# EAGLE design 18500_pack_v1 (EAGLE 9.6.2)
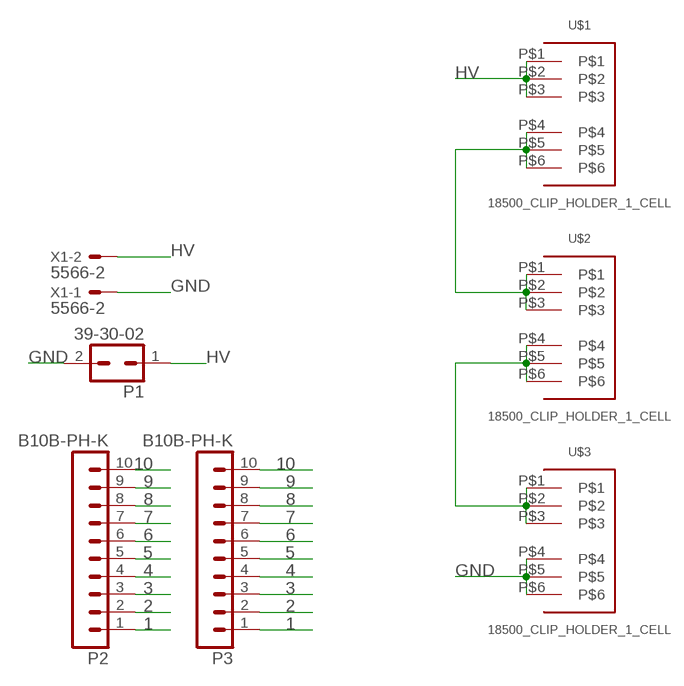
[diagram p0: schematic, sheet 1]

## Parts
P1  39-30-02  [39-30-?02?]
P2  B10B-PH-K  [B10B-PH-K]
P3  B10B-PH-K  [B10B-PH-K]
U$1  18500_CLIP_HOLDER_1_CELL  [3PINBATTERY_CLIP_1_CELL_18500]
U$2  18500_CLIP_HOLDER_1_CELL  [3PINBATTERY_CLIP_1_CELL_18500]
U$3  18500_CLIP_HOLDER_1_CELL  [3PINBATTERY_CLIP_1_CELL_18500]
X1  5566-2  [5566-2]

## Nets
1: P2.1 P3.1
2: P2.2 P3.2
3: P2.3 P3.3
4: P2.4 P3.4
5: P2.5 P3.5
6: P2.6 P3.6
7: P2.7 P3.7
8: P2.8 P3.8
9: P2.9 P3.9
10: P2.10 P3.10
GND: P1.2 U$3.P$4 U$3.P$5 U$3.P$6 X1.1
HV: P1.1 U$1.P$1 U$1.P$2 U$1.P$3 X1.2
N$1: U$1.P$4 U$1.P$5 U$1.P$6 U$2.P$1 U$2.P$2 U$2.P$3
N$2: U$2.P$4 U$2.P$5 U$2.P$6 U$3.P$1 U$3.P$2 U$3.P$3

## Library data of the parts
P1 = con-molex-mini-fit:39-30-?02?: HEADER
P2 P3 = con-jst-ph:B10B-PH-K: HEADER
U$1-U$3 = nathans-custom-parts:18500_CLIP_HOLDER_1_CELL
X1 = con-molex:5566-2: Mini FIT connector 2 pol Source: http://www.molex.com; MF: MOLEX; OC_FARNELL: 1822072; OC_NEWARK: unknown

## Board
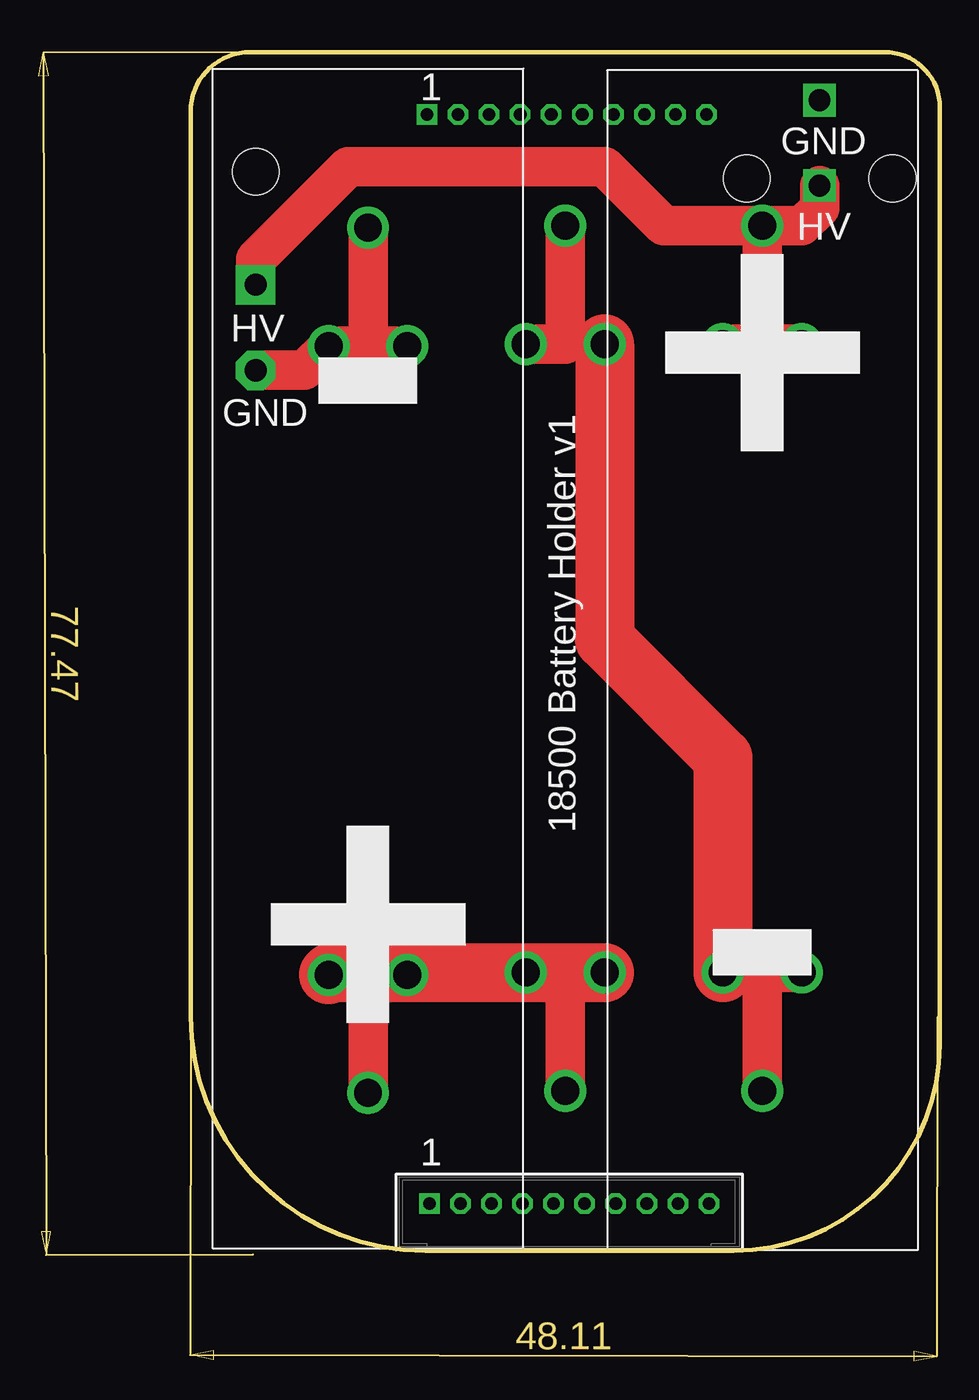
[diagram p1: board, top side]
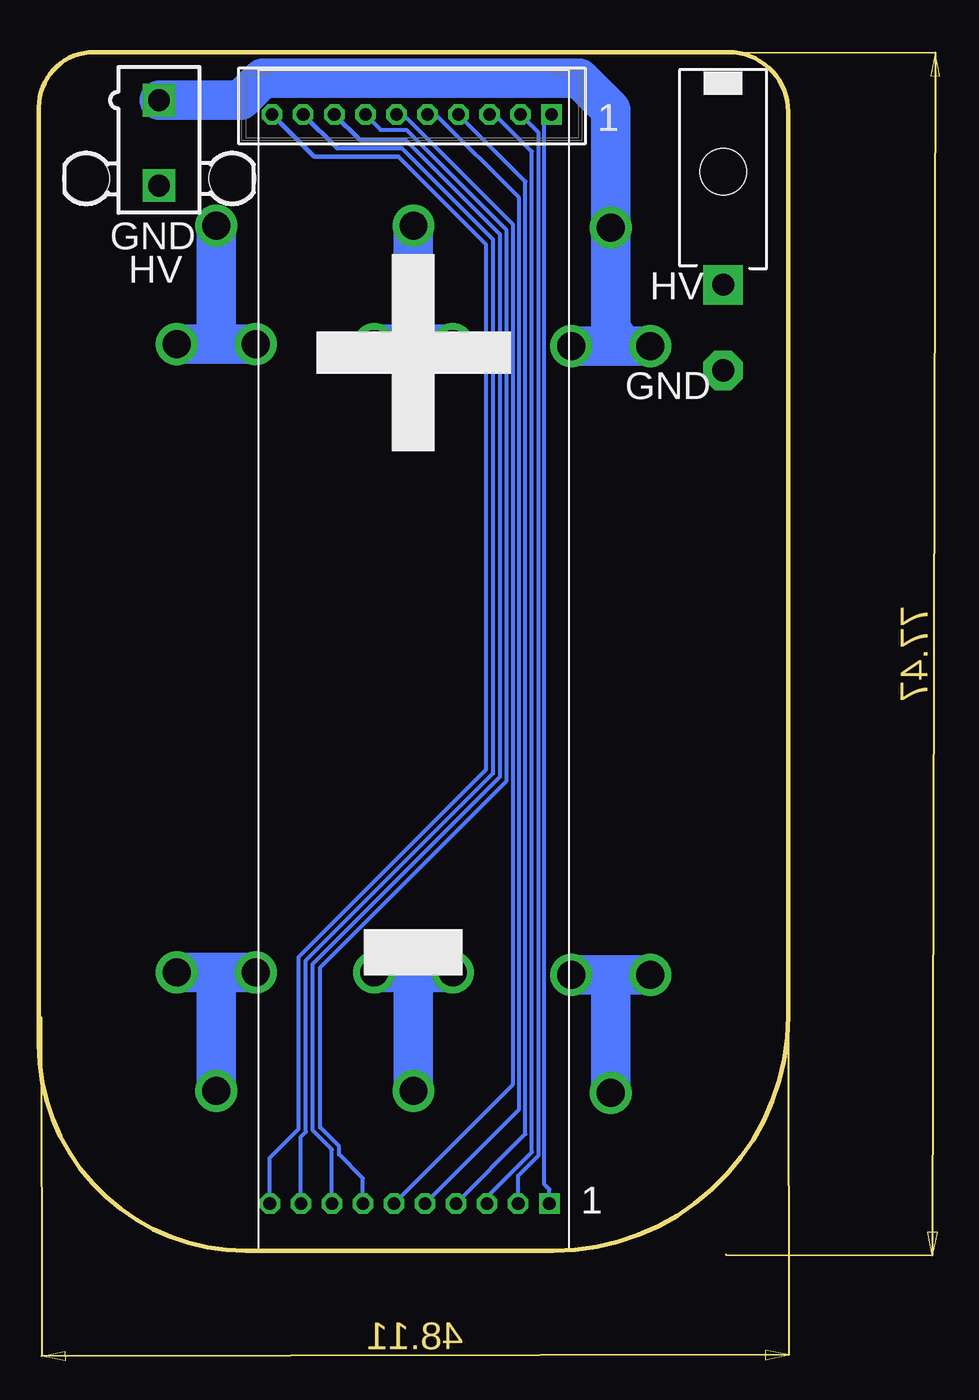
[diagram p2: board, bottom side, seen from below]

Size 48.26 x 77.22 mm. Coordinates in mm from the lower left corner, seen from the top.
Outline: 48.26,13.29 48.26,73.67 arc90 44.72,77.22 3.83,77.22 arc90 0,73.38 0,15.11 arc90 15.11,0 34.97,0 arc90 48.26,13.29
Copper layers (1*16): Top 0.035mm / dielectric 1.5mm / Bottom 0.035mm
Design rules "SeeedStudio_2layer_DRU_no_angle_20140221": minimum track width 6mil, minimum drill 12mil, track to track 6mil, track to pad 6mil, pad to pad 6mil, via to via 6mil, smd to smd 0mil, copper to edge 10mil, drill to drill 10mil, minimum pad ring 10mil, minimum via ring 6mil, stop-mask expansion 2mil, vias tented up to drill 100mil, thermal gap 10mil

### Footprints (pad centres in the part's own frame; a part is rotated, then mirrored left to right if it is on the bottom)
39-30-?02? = drill 1.422 pad 2.54 square: 1 0,0 | drill 1.422 pad 2.54 octagon: 2 0,5.512 | hole 3: 0,-7.3
B10B-PH-K = drill 0.813 square: 1 -9,0 | drill 0.813 octagon: 2 -7,0; 3 -5,0; 4 -3,0; 5 -1,0; 6 1,0; 7 3,0; 8 5,0; 9 7,0; 10 9,0
3PINBATTERY_CLIP_1_CELL_18500 = drill 1.8: P$1 0,0; P$2 7.62,2.54; P$3 7.62,-2.54; P$4 48.12,2.54; P$5 48.12,-2.54; P$6 55.74,0
5566-2 = drill 1.4 square: 1 0,-2.75; 2 0,2.75 | hole 3: 4.7,2.29; -4.7,2.29

### Placement (x,y rotation side)
P1  39-30-02?  [39-30-?02?]  4.19,62.23 180 bottom
P2  24.23,73.2 180 bottom
P3  24.38,3.05 0 top
U$1  36.83,66.04 270 top
U$2  24.13,66.04 270 bottom
U$3  11.43,10.16 90 top
X1  40.51,71.37 180 bottom

### Tracks (layer width: path | path; a pad name or v marks a point on that pad's centre or on a via)
1
  Bottom 0.254: P3.1 15.38,3.95 15.7,4.27 15.7,72.74 P2.1
2
  Bottom 0.254: P3.2 17.38,4.83 16.1,6.11 16.1,72.07 P2.2
3
  Bottom 0.254: 19.38,3.48 16.51,6.35 16.51,70.81 18.9,73.2 P2.3
  Bottom 0.305: P3.3 19.38,3.48
4
  Bottom 0.254: P3.4 16.92,7.52 16.92,68.89 P2.4
5
  Bottom 0.254: P3.5 17.32,9.11 17.32,67.84 22.68,73.2
  Bottom 0.305: 22.68,73.2 P2.5
6
  Bottom 0.254: P2.6 24.8,73.2 17.74,66.14 17.74,10.69 P3.6
7
  Bottom 0.254: P3.7 27.38,4.65 28.93,6.19 28.93,6.71 30.15,7.94 30.15,8.89 30.15,18.24 18.16,30.23 18.16,65.78 24.59,72.21 26.24,72.21 P2.7
8
  Bottom 0.254: P3.8 29.38,6.52 30.61,7.75 30.61,18.49 18.57,30.53 18.57,65.48 24.66,71.58
  Bottom 0.305: P2.8 27.61,71.58 24.66,71.58
9
  Bottom 0.254: P3.9 31.38,7.35 31.06,7.67 31.06,18.69 19.02,30.73 19.02,65.16 24.88,71.02
  Bottom 0.305: 24.88,71.02 29.05,71.02 P2.9
10
  Bottom 0.254: P3.10 33.38,6 31.52,7.86 31.52,18.92 19.48,30.96 19.48,64.86 25.1,70.48
  Bottom 0.305: 25.1,70.48 30.51,70.48 P2.10
GND
  Top 2.54: 11.43,58.28 U$3.P$4 7.33,56.72 P1.2 | 11.43,58.28 U$3.P$5 | U$3.P$6 11.43,58.28
  Bottom 2.54: X1.1 35.26,74.12 33.84,75.54 13.46,75.54 11.43,73.51 U$3.P$6 11.43,59.33 11.12,59.03 11.12,58.59 11.43,58.28 | U$3.P$4 11.43,58.28 | 11.43,58.28 U$3.P$5
HV
  Top 2.54: U$1.P$3 36.83,58.42 | 36.83,58.42 U$1.P$2 | U$1.P$1 36.83,58.42 | X1.2 40.51,67.18 39.37,66.04 U$1.P$1 | U$1.P$1 30.48,66.04 26.67,69.85 10.16,69.85 4.19,63.88 P1.1
  Bottom 2.54: U$1.P$1 36.83,58.62 | U$1.P$3 36.63,58.42 36.83,58.62 | U$1.P$2 37.03,58.42 36.83,58.62
N$1
  Top 2.54: U$2.P$2 24.13,58.42 U$2.P$1 | U$1.P$4 36.83,17.92 | 36.83,17.92 34.43,17.92 34.29,17.78 U$1.P$5 | U$1.P$6 36.83,17.92
  Top 3.81: U$2.P$3 26.67,39.37 34.29,31.75 U$1.P$5
  Bottom 2.54: U$1.P$5 36.88,17.92 | 36.88,17.92 U$1.P$4 | U$1.P$6 36.83,17.87 36.88,17.92 | U$2.P$2 23.82,58.42 | 23.82,58.42 U$2.P$3 | U$2.P$1 24.13,58.73 23.82,58.42
N$2
  Top 2.54: U$2.P$6 24.13,17.92 | U$3.P$1 11.43,17.92
  Top 3.81: U$3.P$2 9.03,17.92 11.43,17.92 24.13,17.92 U$2.P$5
  Bottom 2.54: U$3.P$3 11.18,17.78 | 11.18,17.78 U$3.P$2 | U$2.P$4 23.98,17.92 | 23.98,17.92 U$2.P$5 | U$2.P$6 24.13,17.77 23.98,17.92 | U$3.P$1 11.43,17.53 11.18,17.78

### Text on the board
tNames: 1 | GND | HV | HV | - | + | GND | 18500 Battery Holder v1 | + | - | 1
bNames: 1 | GND | HV | HV | + | GND | - | 1